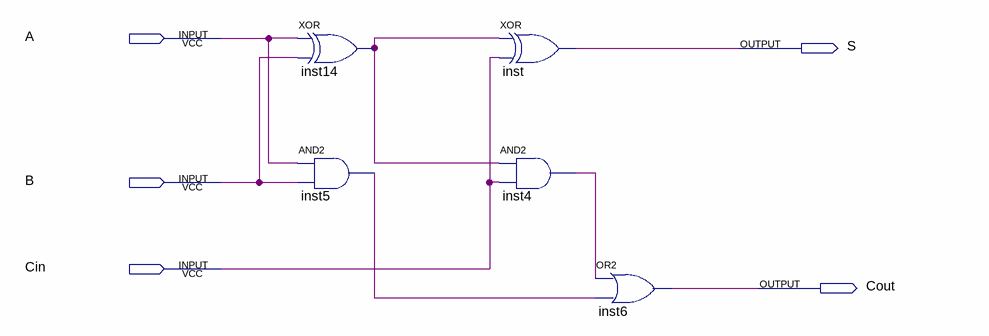
[diagram p0: schematic sheet]
// Quartus schematic full_adder.bdf as structural Verilog: 5 symbols, 5 pins
module full_adder (
  input  A,
  input  B,
  input  Cin,
  output S,
  output Cout
);

  wire inst4_out, inst5_out, inst14_out;

  xor inst14 (inst14_out, A, B);
  and inst5 (inst5_out, A, B);
  xor inst (S, inst14_out, Cin);
  and inst4 (inst4_out, inst14_out, Cin);
  or inst6 (Cout, inst4_out, inst5_out);
endmodule
